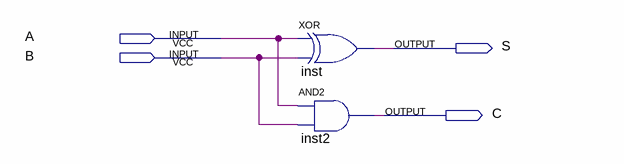
[diagram p0: schematic sheet]
// Quartus schematic week3_1_3.bdf as structural Verilog: 2 symbols, 4 pins
module week3_1_3 (
  input  A,
  input  B,
  output S,
  output C
);

  xor inst (S, A, B);
  and inst2 (C, A, B);
endmodule
